# EAGLE schematic ATMega328-AD_DA_IO-V51-Eagle-Full (EAGLE 6.1)
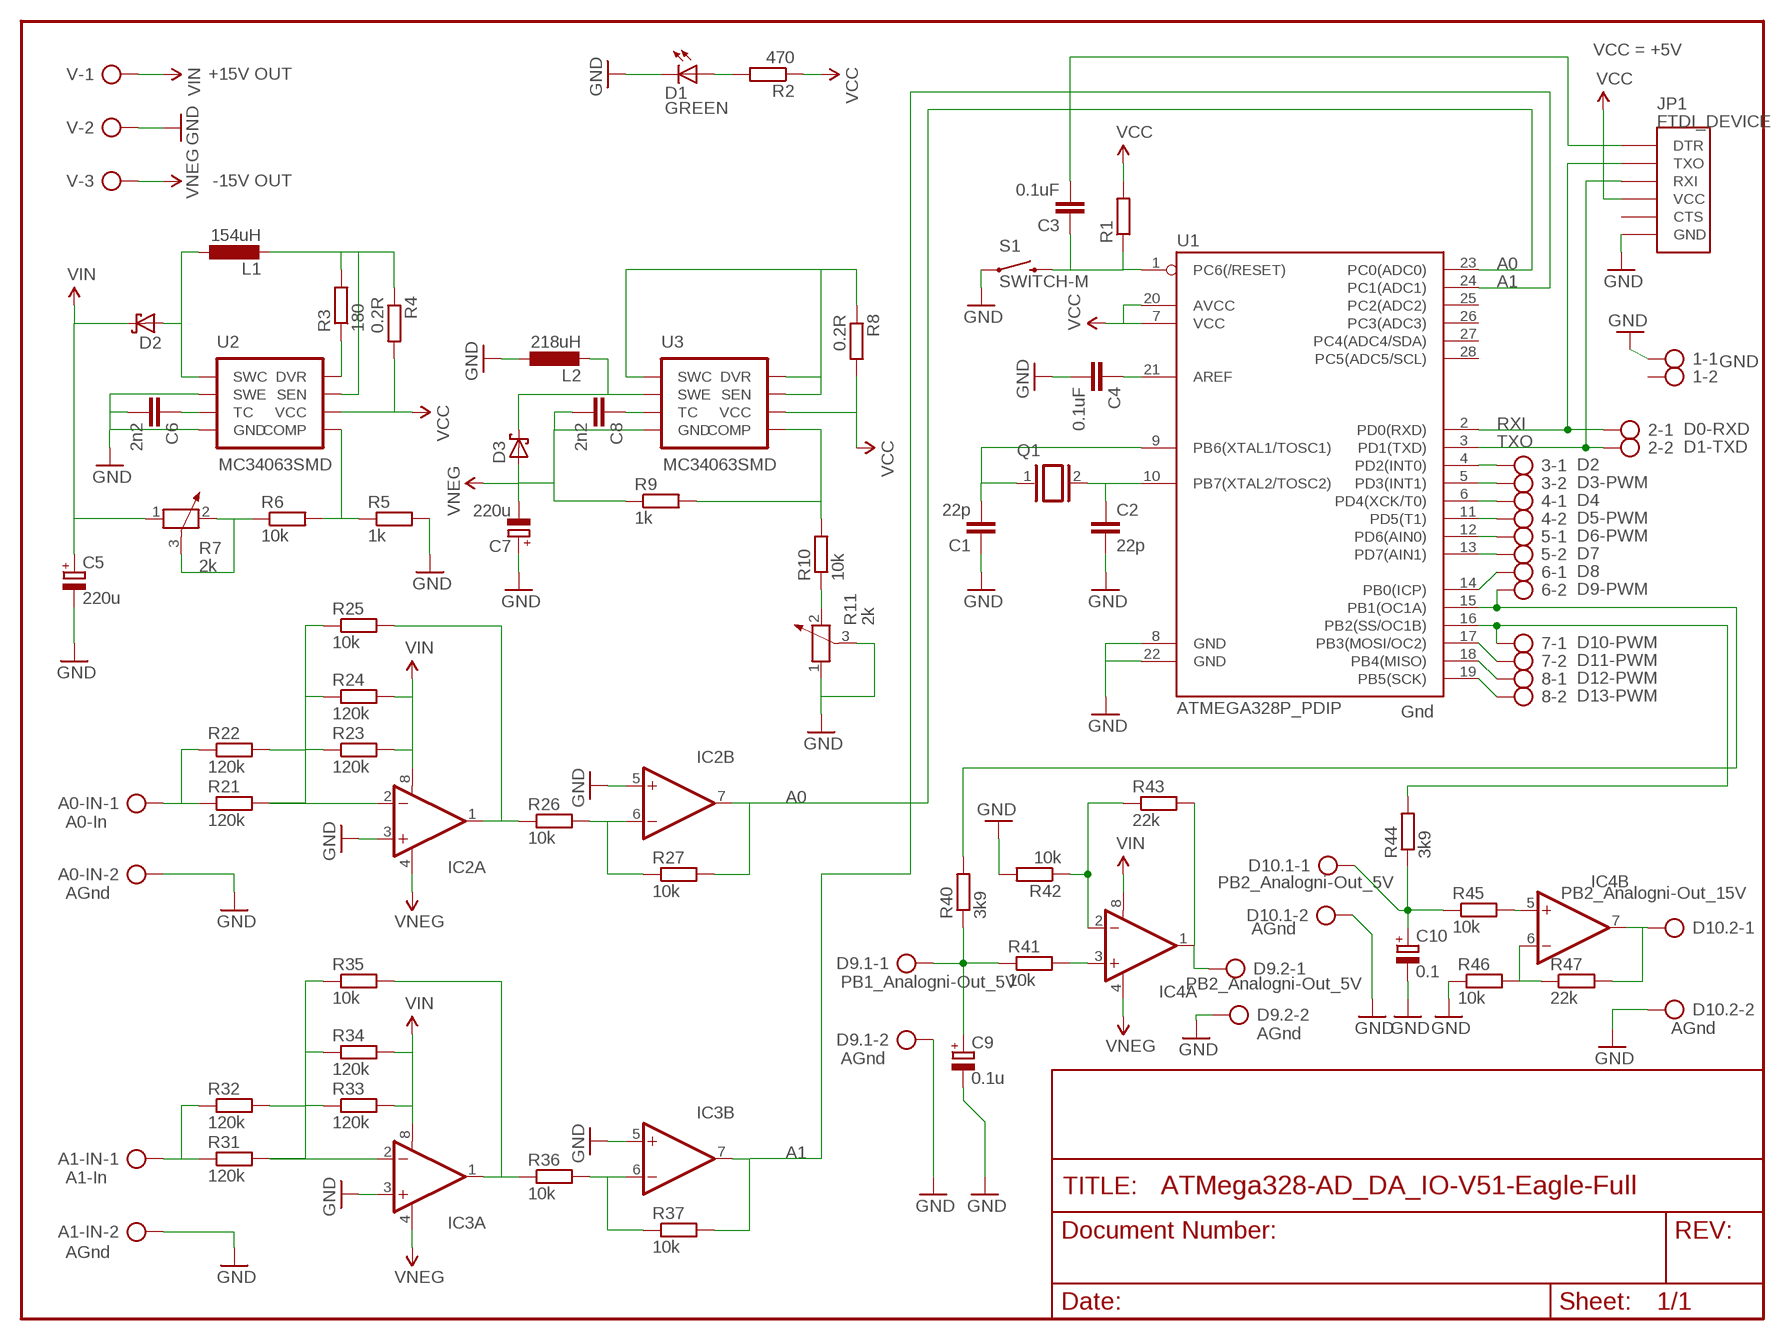
[diagram p0: schematic, sheet 1]

## Parts
1  AK500/2  [AK500/2]
2  AK500/2  [AK500/2]
3  AK500/2  [AK500/2]
4  AK500/2  [AK500/2]
5  AK500/2  [AK500/2]
6  AK500/2  [AK500/2]
7  AK500/2  [AK500/2]
8  AK500/2  [AK500/2]
A0-IN  AK500/2  [AK500/2]
A1-IN  AK500/2  [AK500/2]
C1  22p  C-EUC0805K  [C0805K]
C2  22p  C-EUC0805K  [C0805K]
C3  0.1uF  C-EUC0805K  [C0805K]
C4  0.1uF  C-EUC0805K  [C0805K]
C5  220u  CPOL-EUE3.5-10  [E3,5-10]
C6  2n2  C-EUC0805K  [C0805K]
C7  220u  CPOL-EUE3.5-10  [E3,5-10]
C8  2n2  C-EUC0805K  [C0805K]
C9  0.1u  CPOL-EUE2.5-5  [E2,5-5]
C10  0.1  CPOL-EUE2.5-5  [E2,5-5]
D1  GREEN  LED-GREENLARGE  [LED-1206]
D2  SCHOTTKY-DIODESMD  [SMB]
D3  SCHOTTKY-DIODESMD  [SMB]
D9.1  AK500/2  [AK500/2]
D9.2  AK500/2  [AK500/2]
D10.1  AK500/2  [AK500/2]
D10.2  AK500/2  [AK500/2]
IC2  OPAMP-DUALU  [SO08]
IC3  OPAMP-DUALU  [SO08]
IC4  OPAMP-DUALU  [SO08]
JP1  FTDI_DEVICE  [FTDI_DEVICE_SIDE]
L1  154uH  L-EU0207/2V  [0207/2V]
L2  218uH  L-EU0207/2V  [0207/2V]
Q1  XTAL/S  [QS]
R1  R-EU_M0805  [M0805]
R2  470  R-EU_M0805  [M0805]
R3  180  R-EU_M0805  [M0805]
R4  0.2R  R-EU_0411/12  [0411/12]
R5  1k  R-EU_M0805  [M0805]
R6  10k  R-EU_M0805  [M0805]
R7  2k  POTENTIOMETER_PT-10S  [PT-10S]
R8  0.2R  R-EU_0411/12  [0411/12]
R9  1k  R-EU_M0805  [M0805]
R10  10k  R-EU_M0805  [M0805]
R11  2k  POTENTIOMETER_PT-10S  [PT-10S]
R21  120k  R-EU_M0805  [M0805]
R22  120k  R-EU_M0805  [M0805]
R23  120k  R-EU_M0805  [M0805]
R24  120k  R-EU_M0805  [M0805]
R25  10k  R-EU_M0805  [M0805]
R26  10k  R-EU_M0805  [M0805]
R27  10k  R-EU_M0805  [M0805]
R31  120k  R-EU_M0805  [M0805]
R32  120k  R-EU_M0805  [M0805]
R33  120k  R-EU_M0805  [M0805]
R34  120k  R-EU_M0805  [M0805]
R35  10k  R-EU_M0805  [M0805]
R36  10k  R-EU_M0805  [M0805]
R37  10k  R-EU_M0805  [M0805]
R40  3k9  R-EU_M0805  [M0805]
R41  10k  R-EU_M0805  [M0805]
R42  10k  R-EU_M0805  [M0805]
R43  22k  R-EU_M0805  [M0805]
R44  3k9  R-EU_M0805  [M0805]
R45  10k  R-EU_M0805  [M0805]
R46  10k  R-EU_M0805  [M0805]
R47  22k  R-EU_M0805  [M0805]
S1  SWITCH-M  SWITCH-MOMENTARY-2PTH  [TACTILE-PTH]
U1  ATMEGA328P_PDIP  [DIL28-3]
U2  MC34063SMD  [SO08]
U3  MC34063SMD  [SO08]
V  AK500/3  [AK500/3]

## Nets
GND [vcc]: 1.1 A0-IN.2 A1-IN.2 C1.1 C2.2 C4.2 C5.- C6.2 C7.+ C9.- C10.- D1.C D9.1.2 D9.2.2 D10.1.2 D10.2.2 IC2.3(A:+IN) IC2.5(B:+IN) IC3.3(A:+IN) IC3.5(B:+IN) JP1.P$6(GND) L2.1 R5.2 R11.1 R11.3 R42.2 R46.1 S1.1 U1.8(GND) U1.22(GND) U2.2(SWE) U2.4(GND) V.2
N$1: R3.1 U2.8(DVR)
N$2: D2.A L1.1 U2.1(SWC)
N$3: L1.2 R3.2 R4.1 U2.7(SEN)
N$4: D1.A R2.2
N$5: IC4.5(B:+IN) R45.2
N$6: C9.+ D9.1.1 R40.1 R41.1
N$7: C10.+ D10.1.1 R44.1 R45.1
N$8: IC4.3(A:+IN) R41.2
N$9: IC4.2(A:-IN) R42.1 R43.1
N$10: 6.2 R40.2 U1.15(PB1(OC1A))
N$11: D9.2.1 IC4.1(A:OUT) R43.2
N$12: 8.1 U1.18(PB4(MISO))
N$13: IC4.6(B:-IN) R46.2 R47.1
N$14: 7.1 R44.2 U1.16(PB2(SS/OC1B))
N$15: 8.2 U1.19(PB5(SCK))
N$16: R5.1 R6.2 U2.5(COMP)
N$17: C6.1 U2.3(TC)
N$18: A1-IN.1 R31.1 R32.1
N$19: R6.1 R7.2 R7.3
N$20: A0-IN.1 R21.1 R22.1
N$21: IC2.2(A:-IN) R21.2 R22.2 R23.1 R24.1 R25.1
N$22: IC2.1(A:OUT) R25.2 R26.1
N$23: IC2.6(B:-IN) R26.2 R27.1
N$24: IC3.2(A:-IN) R31.2 R32.2 R33.1 R34.1 R35.1
N$25: IC3.1(A:OUT) R35.2 R36.1
N$26: IC3.6(B:-IN) R36.2 R37.1
N$27: D10.2.1 IC4.7(B:OUT) R47.2
N$28: C8.1 U3.3(TC)
N$29: 3.1 U1.4(PD2(INT0))
N$30: D3.C L2.2 U3.2(SWE)
N$31: R10.1 R11.2
N$32: IC2.7(B:OUT) R27.2 U1.23(PC0(ADC0))
N$33: C3.1 R1.1 S1.3 U1.1(PC6(/RESET))
N$34: C2.1 Q1.2 U1.10(PB7(XTAL2/TOSC2))
N$35: C3.2 JP1.P$1(DTR)
N$36: C4.1 U1.21(AREF)
N$37: 2.1 JP1.P$2(TXO) U1.2(PD0(RXD))
N$38: C1.2 Q1.1 U1.9(PB6(XTAL1/TOSC1))
N$39: 2.2 JP1.P$3(RXI) U1.3(PD1(TXD))
N$40: 3.2 U1.5(PD3(INT1))
N$41: IC3.7(B:OUT) R37.2 U1.24(PC1(ADC1))
N$42: 4.1 U1.6(PD4(XCK/T0))
N$43: 4.2 U1.11(PD5(T1))
N$44: R9.2 R10.2 U3.5(COMP)
N$45: 5.1 U1.12(PD6(AIN0))
N$46: 5.2 U1.13(PD7(AIN1))
N$47: 6.1 U1.14(PB0(ICP))
N$48: R8.1 U3.1(SWC) U3.7(SEN) U3.8(DVR)
N$49: 7.2 U1.17(PB3(MOSI/OC2))
VCC: JP1.P$4(VCC) R1.2 R2.1 R4.2 R8.2 U1.7(VCC) U1.20(AVCC) U2.6(VCC) U3.6(VCC)
VIN: C5.+ D2.C IC2.8(A:V+) IC3.8(A:V+) IC4.8(A:V+) R7.1 R23.2 R24.2 R33.2 R34.2 V.1
VNEG: C7.- C8.2 D3.A IC2.4(A:V-) IC3.4(A:V-) IC4.4(A:V-) R9.1 U3.4(GND) V.3
Unconnected: 1.2 JP1.P$5(CTS) U1.25(PC2(ADC2)) U1.26(PC3(ADC3)) U1.27(PC4(ADC4/SDA)) U1.28(PC5(ADC5/SCL))

## Notes on the sheet
- VCC = +5V
- +15V OUT
- -15V OUT
- A0
- A1
- GND
- RXI
- D0-RXD
- TXO
- D1-TXD
- D2
- D3-PWM
- D4
- D5-PWM
- D6-PWM
- D7
- D8
- D9-PWM
- D10-PWM
- D11-PWM
- D12-PWM
- D13-PWM
- Gnd
- A0
- A0-In
- PB2_Analogni-Out_5V
- AGnd | PB2_Analogni-Out_15V
- AGnd
- PB1_Analogni-Out_5V | PB2_Analogni-Out_5V
- AGnd
- AGnd
- AGnd
- A1
- A1-In
- AGnd

## Library data of the parts
1-8 A0-IN A1-IN D9.1 D9.2 D10.1 D10.2 = con-ptr500:AK500/2: CONNECTOR; OC_FARNELL: unknown; OC_NEWARK: unknown
C1-C4 C6 C8 = rcl:C-EU: CAPACITOR, European symbol
C5 C7 C9 C10 = rcl:CPOL-EU: POLARIZED CAPACITOR, European symbol
D1 = SparkFun-LED:LED-GREEN: Various green LEDs 0603- DIO-00821 LARGE- DIO-00862 LILYPAD- DIO-09910; PROD_ID: DIO-00862
D2 D3 = diode:SCHOTTKY-DIODE: Schottky Diode
IC2-IC4 = SparkFun-AnalogIC:OPAMP-DUAL: Generic op-amp footprint
JP1 = SparkFun-Connectors:FTDI_DEVICE: Connector which mates to FTDI basic or FTDI cable.
L1 L2 = rcl:L-EU: INDUCTOR, European symbol
Q1 = special:XTAL/S: CRYSTAL
R1-R6 R8-R10 R21-R27 R31-R37 R40-R47 = rcl:R-EU_: RESISTOR, European symbol
R7 R11 = rcl:POTENTIOMETER_: Potentiometer
S1 = SparkFun-Electromechanical:SWITCH-MOMENTARY-2: Various NO switches- pushbuttons, reed, etc
U1 = SparkFun-DigitalIC:ATMEGA328P_PDIP: uC used in the Arduino 32kb flash, 1k EEPROM, 2k SRAM This is the through-hole version of this chip.
U2 U3 = SparkFun-PowerIC:MC34063: Jellybean switching supply controller
V = con-ptr500:AK500/3: CONNECTOR; OC_FARNELL: unknown; OC_NEWARK: unknown

## Net classes
0 default: width 0.203 mm
1 vcc: width 0.254 mm